# Altium schematic sheet 4_BLE-T1_power.SchDoc: PCA10056 - nRF52840 MCU
size A3; Organization: Nordic Semiconductor; DocumentNumber: 2; SheetNumber: 2; SheetTotal: 7; CompanyName: Nordic Semiconductor
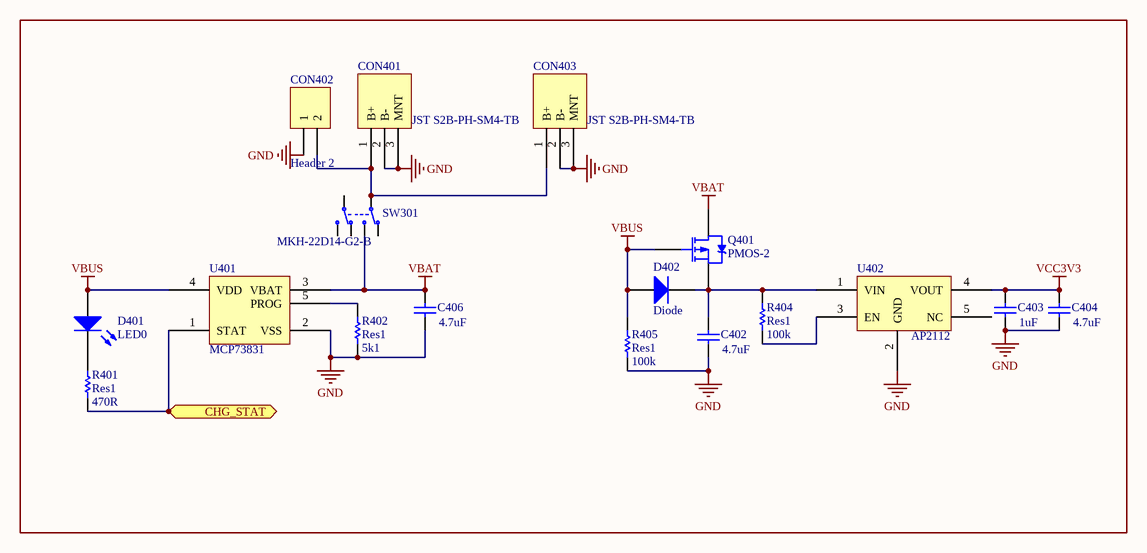
[diagram p0: 4_BLE-T1_power.SchDoc]

## Parts
C402  value 4.7uF  [C1206[3216]]
C403  value 1uF  [C0603[1608]]
C404  value 4.7uF  [C1206[3216]]
C406  value 4.7uF  [C1206[3216]]
CON401  JST S2B-PH-SM4-TB  [JST S2B-PH-SM4-TB]
CON402  Header 2  [HDR1X2]  (no BOM)
CON403  JST S2B-PH-SM4-TB  [JST SM02B-SRSS-TB]
D401  LED0  [LED0603[1608]]
D402  Diode  [D0603[1608]]
Q401  PMOS-2  [SOT-23-3]
R401  Res1  value 470R  [R0603[1608]]
R402  Res1  value 5k1  [R0603[1608]]
R404  Res1  value 100k  [R0603[1608]]
R405  Res1  value 100k  [R0603[1608]]
SW301  MKH-22D14-G2-B  [MKH-22D14-G2-B]
U401  MCP73831  [SOT-23-5]
U402  AP2112  [SOT-23-5]

## Ports
CHG_STAT

## Nets
GND: C402.1 C403.1 C404.1 C406.1 CON401.2(B-) CON401.3(MNT) CON402.1 CON403.2(B-) CON403.3(MNT) R402.2 R405.2 U401.2(VSS) U402.2(GND)
VBAT: C406.2 Q401.3(D) SW301.1(N.O-1) U401.3(VBAT)
VBUS: D401.1(A) D402.1(A) Q401.1(G) R405.1 U401.4(VDD)
VCC3V3: C403.2 C404.2 U402.4(VOUT)
CHG_STAT: R401.2 U401.1(STAT) ; port CHG_STAT
NetC402_2: C402.2 D402.2(K) Q401.2(S) R404.1 U402.1(VIN)
NetCON401_1: CON401.1(B+) CON402.2 CON403.1(B+) SW301.2(COM-1)
NetD401_2: D401.2(K) R401.1
NetR402_1: R402.1 U401.5(PROG)
NetR404_2: R404.2 U402.3(EN)

Not connected (* = marked no-connect by the designer): SW301 3(N.C-1) 4(N.O-2) 5(COM-2) 6(N.C-2); U402 5(NC)

## Notes on the sheet
- Title
- Size:
- Date:
- A3
- Number:
- Time:
- Revision:
- Sheet
- of
- File:

## Library data of the parts
C402 C404 C406 = Cap: Capacitor; Version: 1206 imperial
C403 = Cap: Capacitor; MRF.Part: 1206B475K500NT; MFG: KEMET; MFGPN: C0603C104M5RACTU; LCSC MFG: Guangdong Fenghua Advanced Tech; Version: 0603 imperial; LCSCPN: C29823
CON401 CON403 = JST S2B-PH-SM4-TB: MFGPN: S2B-PH-SM4-TB(LF)(SN); MFG: JST Sales America Inc.
CON402 = Header 2: Header, 2-Pin
D401 = LED0: Typical INFRARED GaAs LED; MFGPN: AM2520SECK09; MFG: Kingbright
D402 = Diode: Default Diode; Published: 8-Jun-2000; LatestRevisionDate: 17-Jul-2002; LatestRevisionNote: Re-released for DXP Platform.; PackageVersion: Sep-1996; PackageReference: SMC; Publisher: Altium Limited; PackageDescription: DO-214-AB/SMC; 2 C-Bend Leads; Body 7.9 x 5.9 mm, inc. leads (LxW); Code_JEDEC: DO-214-AB
Q401 = PMOS-2: P-Channel Power MOSFET; Note: Pin 4 not drawn and electrically connected to Pin 2.; MFGPN: BSS84-7-F; Published: 8-Jun-2000; LatestRevisionDate: 17-Jul-2002; LatestRevisionNote: Re-released for DXP Platform.; DatasheetVersion: PD-9.390D; PackageVersion: Feb-1997; PackageReference: TO-220AB; Publisher: Altium Limited; PackageDescription: TO, Thru-Hole, Vertical, Heatsink Mounted; 3 In-Line Leads; Pitch 2.54 mm; ComponentLink1Description: Manufacturer Link; ComponentLink1URL: http://www.irf.com/; LCSCPN: C427395
R401 R402 R404 R405 = Res1: Resistor; MFG: TE Connectivity Passive Product; MFGPN: CRGCQ0603F150R; Version: 0603 imperial
SW301 = MKH-22D14-G2-B: Slide Switch DPDT; MFG: Nidec Copal Electronics; MFGPN: CL-SB-22B-11T; Value: MKH-22D14-G2-B